# Altium project instaspin_bldc_driver.PrjPcb
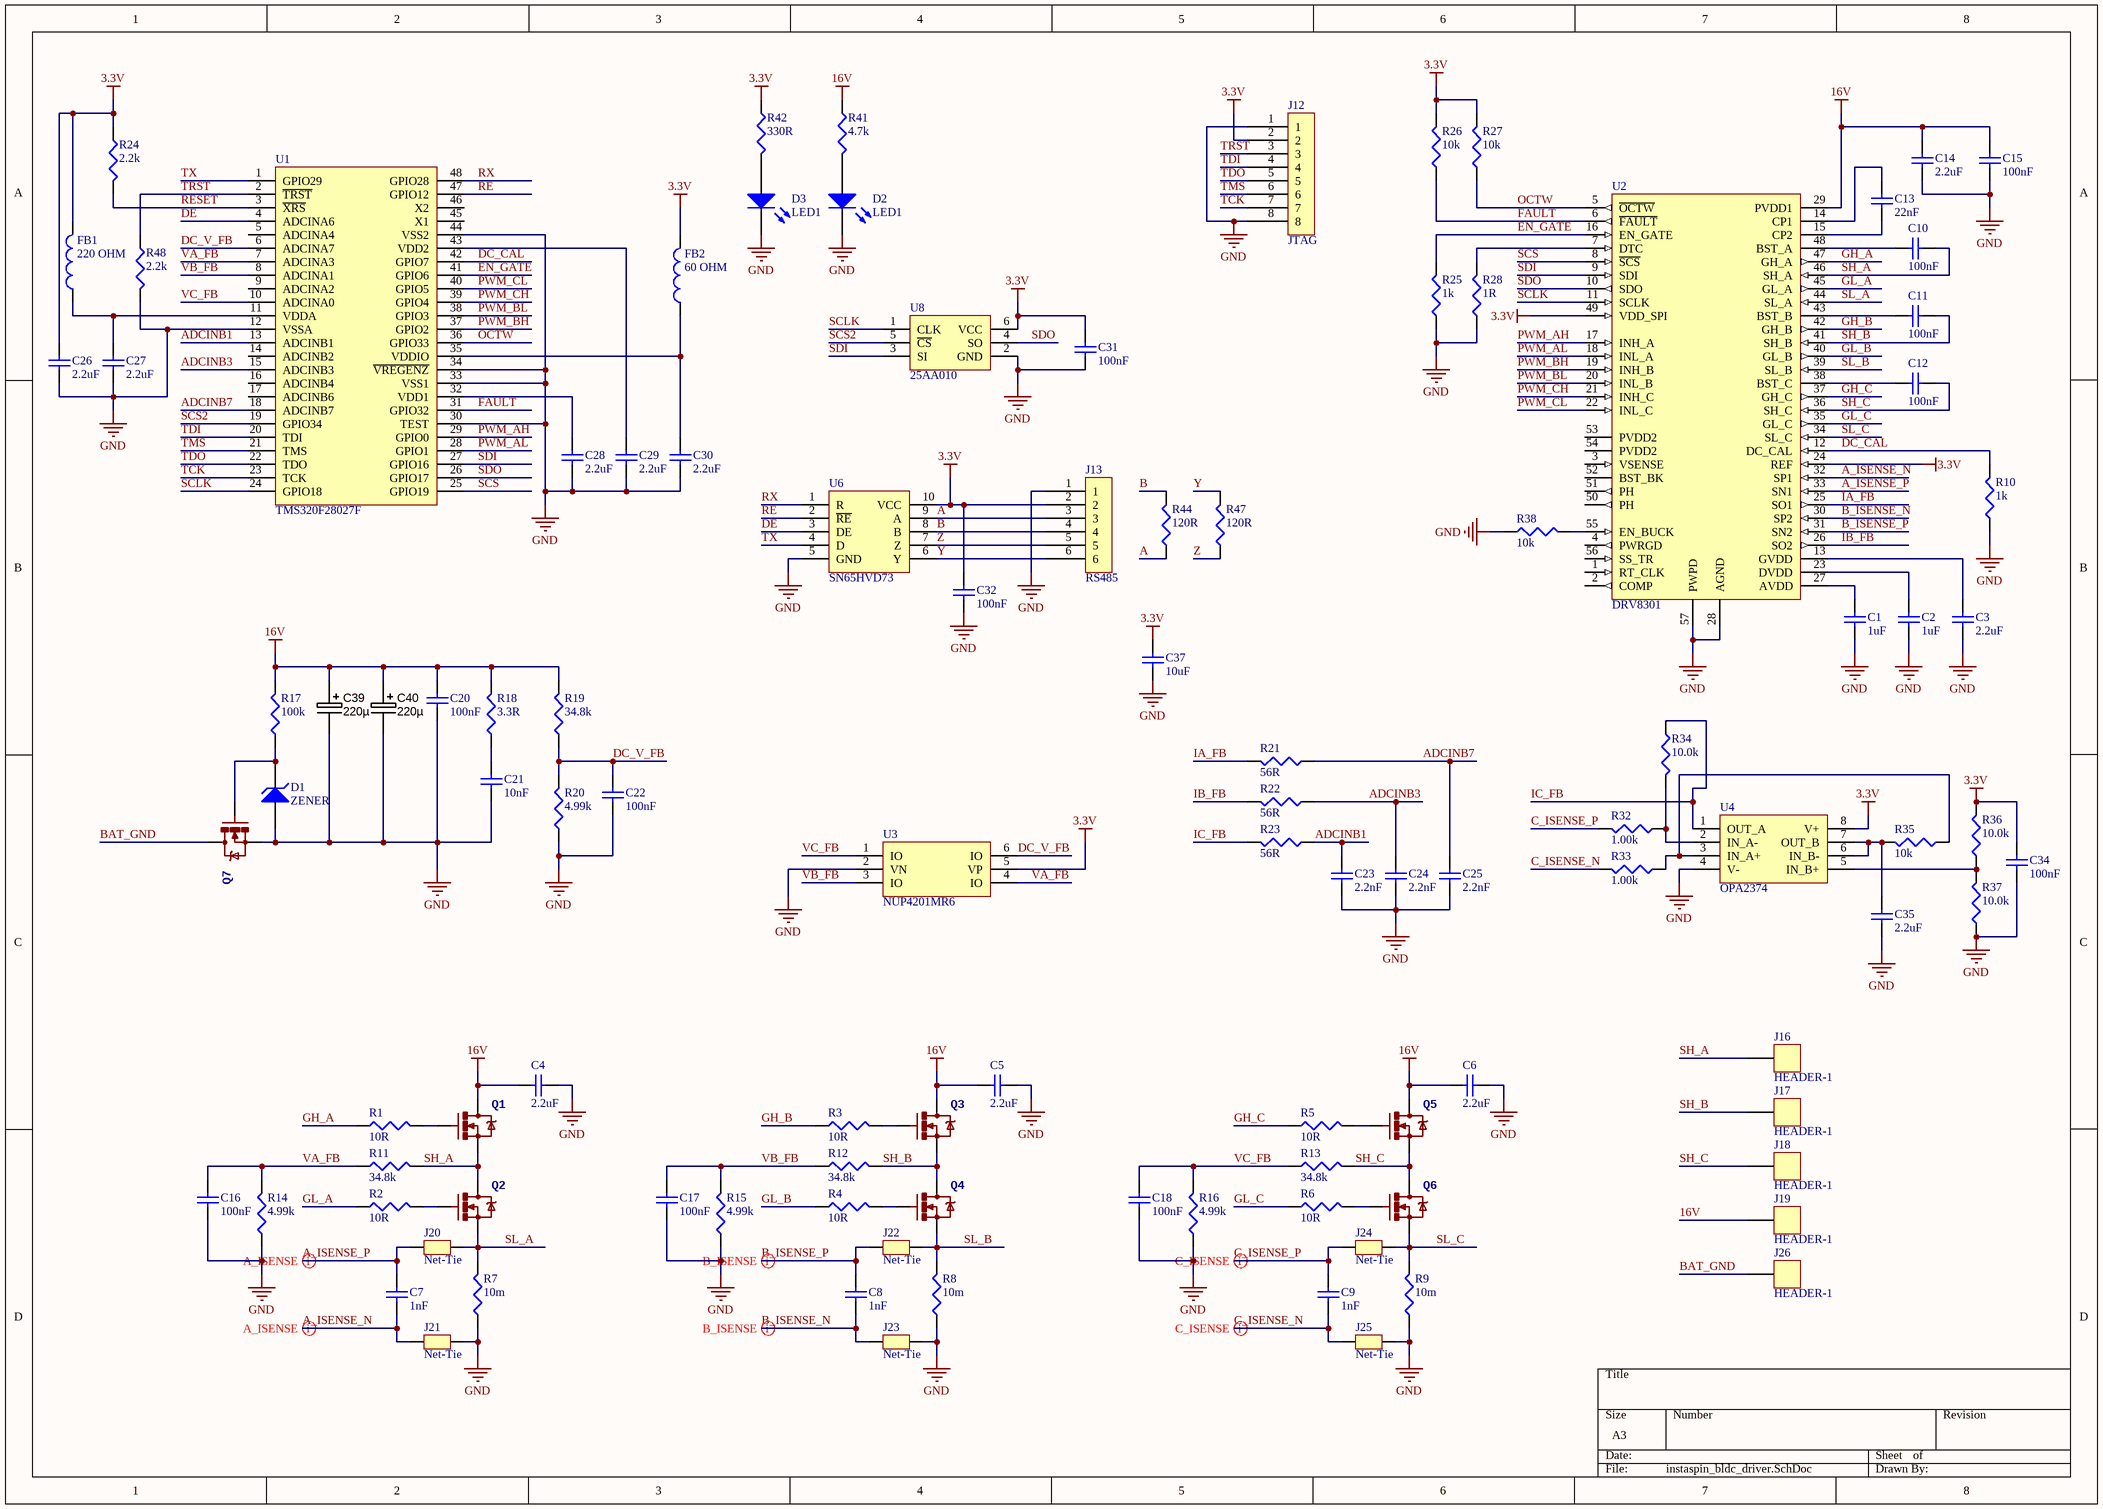
[diagram p0: instaspin_bldc_driver.SchDoc]
1 sheet, 107 parts. Net scope: global (net labels, ports and power ports of the same name join across sheets).
Board file: instaspin_bldc_driver.PcbDoc

## Sheet instaspin_bldc_driver.SchDoc
size A3

### Parts
C1  1uF  [1608[0603]]
C2  1uF  [1608[0603]]
C3  2.2uF  [1608[0603]]
C4  2.2uF  [C1206]
C5  2.2uF  [C1206]
C6  2.2uF  [C1206]
C7  1nF  [1608[0603]]
C8  1nF  [1608[0603]]
C9  1nF  [1608[0603]]
C10  100nF  [1608[0603]]
C11  100nF  [1608[0603]]
C12  100nF  [1608[0603]]
C13  22nF  [1608[0603]]
C14  2.2uF  [C1206]
C15  100nF  [1608[0603]]
C16  100nF  [1608[0603]]
C17  100nF  [1608[0603]]
C18  100nF  [1608[0603]]
C20  100nF  [1608[0603]]
C21  10nF  [1608[0603]]
C22  100nF  [1608[0603]]
C23  2.2nF  [1608[0603]]
C24  2.2nF  [1608[0603]]
C25  2.2nF  [1608[0603]]
C26  2.2uF  [1608[0603]]
C27  2.2uF  [1608[0603]]
C28  2.2uF  [1608[0603]]
C29  2.2uF  [1608[0603]]
C30  2.2uF  [1608[0603]]
C31  100nF  [1608[0603]]
C32  100nF  [1608[0603]]
C34  100nF  [1608[0603]]
C35  2.2uF  [1608[0603]]
C37  10uF  [C1206]
C39  220µ  [CAP_ELEC_6.3x4.2]
C40  220µ  [CAP_ELEC_6.3x4.2]
D1  ZENER  [SODFL370X135-2N]
D2  LED1  [1608[0603]]
D3  LED1  [1608[0603]]
FB1  220 OHM  [INDC1608L]
FB2  60 OHM  [INDC1608L]
J12  JTAG  [MICRO-MATCH-8]
J13  RS485  [MICRO-MATCH-6]
J16  HEADER-1  [2MM-BANANA-SOCKET]
J17  HEADER-1  [2MM-BANANA-SOCKET]
J18  HEADER-1  [2MM-BANANA-SOCKET]
J19  HEADER-1  [2MM-BANANA-SOCKET]
J20  Net-Tie  [NET-TIE-0803]  (net tie, no BOM)
J21  Net-Tie  [NET-TIE-0803]  (net tie, no BOM)
J22  Net-Tie  [NET-TIE-0803]  (net tie, no BOM)
J23  Net-Tie  [NET-TIE-0803]  (net tie, no BOM)
J24  Net-Tie  [NET-TIE-0803]  (net tie, no BOM)
J25  Net-Tie  [NET-TIE-0803]  (net tie, no BOM)
J26  HEADER-1  [2MM-BANANA-SOCKET]
Q1  MOSFET-N  [SOT669]  (value not drawn)
Q2  MOSFET-N  [SOT669]  (value not drawn)
Q3  MOSFET-N  [SOT669]  (value not drawn)
Q4  MOSFET-N  [SOT669]  (value not drawn)
Q5  MOSFET-N  [SOT669]  (value not drawn)
Q6  MOSFET-N  [SOT669]  (value not drawn)
Q7  MOSFET-N  [SOT669]  (value not drawn)
R1  10R  [J1-0603]
R2  10R  [J1-0603]
R3  10R  [J1-0603]
R4  10R  [J1-0603]
R5  10R  [J1-0603]
R6  10R  [J1-0603]
R7  10m  [2512M]
R8  10m  [2512M]
R9  10m  [2512M]
R10  1k  [J1-0603]
R11  34.8k  [J1-0603]
R12  34.8k  [J1-0603]
R13  34.8k  [J1-0603]
R14  4.99k  [J1-0603]
R15  4.99k  [J1-0603]
R16  4.99k  [J1-0603]
R17  100k  [J1-0603]
R18  3.3R  [C1206]
R19  34.8k  [J1-0603]
R20  4.99k  [J1-0603]
R21  56R  [J1-0603]
R22  56R  [J1-0603]
R23  56R  [J1-0603]
R24  2.2k  [J1-0603]
R25  1k  [J1-0603]
R26  10k  [J1-0603]
R27  10k  [J1-0603]
R28  1R  [J1-0603]
R32  1.00k  [J1-0603]
R33  1.00k  [J1-0603]
R34  10.0k  [J1-0603]
R35  10k  [J1-0603]
R36  10.0k  [J1-0603]
R37  10.0k  [J1-0603]
R38  10k  [J1-0603]
R41  4.7k  [J1-0603]
R42  330R  [J1-0603]
R44  120R  [J1-0603]
R47  120R  [J1-0603]
R48  2.2k  [J1-0603]
U1  TMS320F28027F  [PQFP48]
U2  DRV8301  [SO56_POWERPAD]
U3  NUP4201MR6  [TSOP-6]
U4  OPA2374  [SOT23-8]
U6  SN65HVD73  [SOP10]
U8  25AA010  [TSOT-23-6]

### Nets
3.3V: C26.2 C31.1 C32.1 C34.2 C37.2 FB1.2 FB2.2 J12.2 J13.2 R24.1 R26.2 R27.2 R36.2 R42.1 U2.24(REF) U2.49(VDD_SPI) U3.5(VP) U4.8(V+) U6.10(VCC) U8.6(VCC)
16V: C4.1 C5.1 C6.1 C14.2 C15.1 C20.2 C39.1 C40.1 J19.1 Q1.D Q3.D Q5.D R17.2 R18.2 R19.2 R41.1 U2.29(PVDD1)
GND: C1.1 C2.1 C3.1 C4.2 C5.2 C6.2 C14.1 C15.2 C16.1 C17.1 C18.1 C20.1 C21.1 C22.1 C23.1 C24.1 C25.1 C26.1 C27.1 C28.1 C29.1 C30.1 C31.2 C32.2 C34.1 C35.1 C37.1 C39.2 C40.2 D1.2 D2.2(K) D3.2(K) J12.1 J12.8 J13.1 J21.2 J23.2 J25.2 Q7.S R7.1 R8.1 R9.1 R10.1 R14.1 R15.1 R16.1 R20.1 R25.1 R28.1 R37.1 R38.1 R48.2 U1.12(VSSA) U1.30(TEST) U1.33(VSS1) U1.34(~{VREGENZ}) U1.44(VSS2) U2.28(AGND) U2.57(PWPD) U3.2(VN) U4.4(V-) U6.5(GND) U8.2(GND)
A: J13.3 R44.1 U6.9(A)
A_ISENSE_N: C7.1 J21.1 U2.32(SP1)
A_ISENSE_P: C7.2 J20.1 U2.33(SN1)
ADCINB1: C23.2 R23.1 U1.13(ADCINB1)
ADCINB3: C24.2 R22.1 U1.15(ADCINB3)
ADCINB7: C25.2 R21.1 U1.18(ADCINB7)
B: J13.4 R44.2 U6.8(B)
B_ISENSE_N: C8.1 J23.1 U2.30(SP2)
B_ISENSE_P: C8.2 J22.1 U2.31(SN2)
BAT_GND: J26.1 Q7.D
C_ISENSE_N: C9.1 J25.1 R33.2
C_ISENSE_P: C9.2 J24.1 R32.2
DC_CAL: R10.2 U1.42(GPIO7) U2.12(DC_CAL)
DC_V_FB: C22.2 R19.1 R20.2 U1.6(ADCINA7) U3.6(IO)
DE: U1.4(ADCINA6) U6.3(DE)
EN_GATE: R25.2 U1.41(GPIO6) U2.16(EN_GATE)
FAULT: R26.1 U1.31(GPIO32) U2.6(~{FAULT})
GH_A: R1.1 U2.47(GH_A)
GH_B: R3.1 U2.42(GH_B)
GH_C: R5.1 U2.37(GH_C)
GL_A: R2.1 U2.45(GL_A)
GL_B: R4.1 U2.40(GL_B)
GL_C: R6.1 U2.35(GL_C)
IA_FB: R21.2 U2.25(SO1)
IB_FB: R22.2 U2.26(SO2)
IC_FB: R23.2 R34.1 U4.1(OUT_A)
OCTW: R27.1 U1.36(GPIO33) U2.5(~{OCTW})
PWM_AH: U1.29(GPIO0) U2.17(INH_A)
PWM_AL: U1.28(GPIO1) U2.18(INL_A)
PWM_BH: U1.37(GPIO2) U2.19(INH_B)
PWM_BL: U1.38(GPIO3) U2.20(INL_B)
PWM_CH: U1.39(GPIO4) U2.21(INH_C)
PWM_CL: U1.40(GPIO5) U2.22(INL_C)
RE: U1.47(GPIO12) U6.2(~{RE})
RESET: R24.2 U1.3(~{XRS})
RX: U1.48(GPIO28) U6.1(R)
SCLK: U1.24(GPIO18) U2.11(SCLK) U8.1(CLK)
SCS: U1.25(GPIO19) U2.8(~{SCS})
SCS2: U1.19(GPIO34) U8.5(~{CS})
SDI: U1.27(GPIO16) U2.9(SDI) U8.3(SI)
SDO: U1.26(GPIO17) U2.10(SDO) U8.4(SO)
SH_A: C10.1 J16.1 Q1.S Q2.D R11.2 U2.46(SH_A)
SH_B: C11.1 J17.1 Q3.S Q4.D R12.2 U2.41(SH_B)
SH_C: C12.1 J18.1 Q5.S Q6.D R13.2 U2.36(SH_C)
SL_A: J20.2 Q2.S R7.2 U2.44(SL_A)
SL_B: J22.2 Q4.S R8.2 U2.39(SL_B)
SL_C: J24.2 Q6.S R9.2 U2.34(SL_C)
TCK: J12.7 U1.23(TCK)
TDI: J12.4 U1.20(TDI)
TDO: J12.5 U1.22(TDO)
TMS: J12.6 U1.21(TMS)
TRST: J12.3 R48.1 U1.2(~{TRST})
TX: U1.1(GPIO29) U6.4(D)
VA_FB: C16.2 R11.1 R14.2 U1.7(ADCINA3) U3.4(IO)
VB_FB: C17.2 R12.1 R15.2 U1.8(ADCINA1) U3.3(IO)
VC_FB: C18.2 R13.1 R16.2 U1.10(ADCINA0) U3.1(IO)
Y: J13.6 R47.2 U6.6(Y)
Z: J13.5 R47.1 U6.7(Z)
NetC1_2: C1.2 U2.27(AVDD)
NetC2_2: C2.2 U2.23(DVDD)
NetC3_2: C3.2 U2.13(GVDD)
NetC10_2: C10.2 U2.48(BST_A)
NetC11_2: C11.2 U2.43(BST_B)
NetC12_2: C12.2 U2.38(BST_C)
NetC13_1: C13.1 U2.14(CP1)
NetC13_2: C13.2 U2.15(CP2)
NetC21_2: C21.2 R18.1
NetC27_2: C27.2 FB1.1 U1.11(VDDA)
NetC28_2: C28.2 U1.32(VDD1)
NetC29_2: C29.2 U1.43(VDD2)
NetC30_2: C30.2 FB2.1 U1.35(VDDIO)
NetC35_2: C35.2 R35.2 U4.6(IN_B-) U4.7(OUT_B)
NetD1_1: D1.1 Q7.G R17.1
NetD2_1: D2.1(A) R41.2
NetD3_1: D3.1(A) R42.2
NetQ1_G: Q1.G R1.2
NetQ2_G: Q2.G R2.2
NetQ3_G: Q3.G R3.2
NetQ4_G: Q4.G R4.2
NetQ5_G: Q5.G R5.2
NetQ6_G: Q6.G R6.2
NetR28_2: R28.2 U2.7(DTC)
NetR32_1: R32.1 R34.2 U4.2(IN_A-)
NetR33_1: R33.1 R35.1 U4.3(IN_A+)
NetR36_1: R36.1 R37.2 U4.5(IN_B+)
NetR38_2: R38.2 U2.55(EN_BUCK)

Not connected (* = marked no-connect by the designer): U1 5(ADCINA4) 9(ADCINA2) 14(ADCINB2) 16(ADCINB4) 17(ADCINB6) 45(X1) 46(X2); U2 1(RT_CLK) 2(COMP) 3(VSENSE) 4(PWRGD) 50(PH) 51(PH) 52(BST_BK) 53(PVDD2) 54(PVDD2) 56(SS_TR)

### Layout directives
differential pair: A_ISENSE_N, A_ISENSE_P, B_ISENSE_N, B_ISENSE_P, C_ISENSE_N, C_ISENSE_P

### Library data of the parts
C1-C18 C20-C32 C34 C35 C37 = Cap Semi: Capacitor (Semiconductor SIM Model); Value: 100pF; Published: 8-Jun-2000; LatestRevisionDate: 29-May-2009; LatestRevisionNote: IPC-7351 Footprint Added.; PackageReference: C1206; Publisher: Altium Limited; PackageDescription: Chip Capacitor
C39 C40 = CAPE_470u_16V_THT: Capacitor THT Alum Elec 470uF 20% 16V; Manufacturer 1: NICHICON; Manufacturer Part Number 1: UHM1C471MPD6; Ratings: 16V; 105°C; Material: Al Electrolytic; SCDType: undef; Package / Case: Radial; Tolerance: ±20%; Supplier 1: Newark; Supplier Part Number 1: 54K8151; Manufacturer 2: JD; Manufacturer Part Number 2: GT470UF16V_10x12mm; Value: 220µ
D1 = ZENER-DIODE
D2 D3 = LED1: Typical RED GaAs LED; Published: 8-Jun-2000; LatestRevisionDate: 08-Jul-2005; LatestRevisionNote: Mech Layer 1 removed.; PackageReference: LED-1; Publisher: Altium Limited; PackageDescription: LED; 2 Leads
FB1 FB2 = Inductor: Ferrite; Code_IEC: 1005; Value: 10mH; Published: 8-Jun-2000; LatestRevisionDate: 29-May-2009; LatestRevisionNote: IPC-7351 Footprint Added.; PackageReference: 0402-A; Publisher: Altium Limited; PackageDescription: Chip Inductor; Code_JEITA: 0402
J12 = HEADER-8
J13 = HEADER-6
Q1-Q7 = MOSFET-N: PROD_ID: IC-08089
R1-R9 R11-R24 R26-R28 R32-R38 R41 R42 R44 R47 R48 = Res3: Resistor; Value: 1K; Published: 8-Jun-2000; LatestRevisionDate: 29-May-2009; LatestRevisionNote: IPC-7351 Footprint Added.; PackageReference: J1-0603; Publisher: Altium Limited; PackageDescription: Chip Resistor
R10 R25 = Res3: Resistor; Published: 8-Jun-2000; LatestRevisionDate: 29-May-2009; LatestRevisionNote: IPC-7351 Footprint Added.; PackageReference: J1-0603; Publisher: Altium Limited; PackageDescription: Chip Resistor; Value: 1K
U6 = SN65HVD3086E
U8 = 25AA010: EEPROM